# EAGLE design motadora (EAGLE 8.2.2)
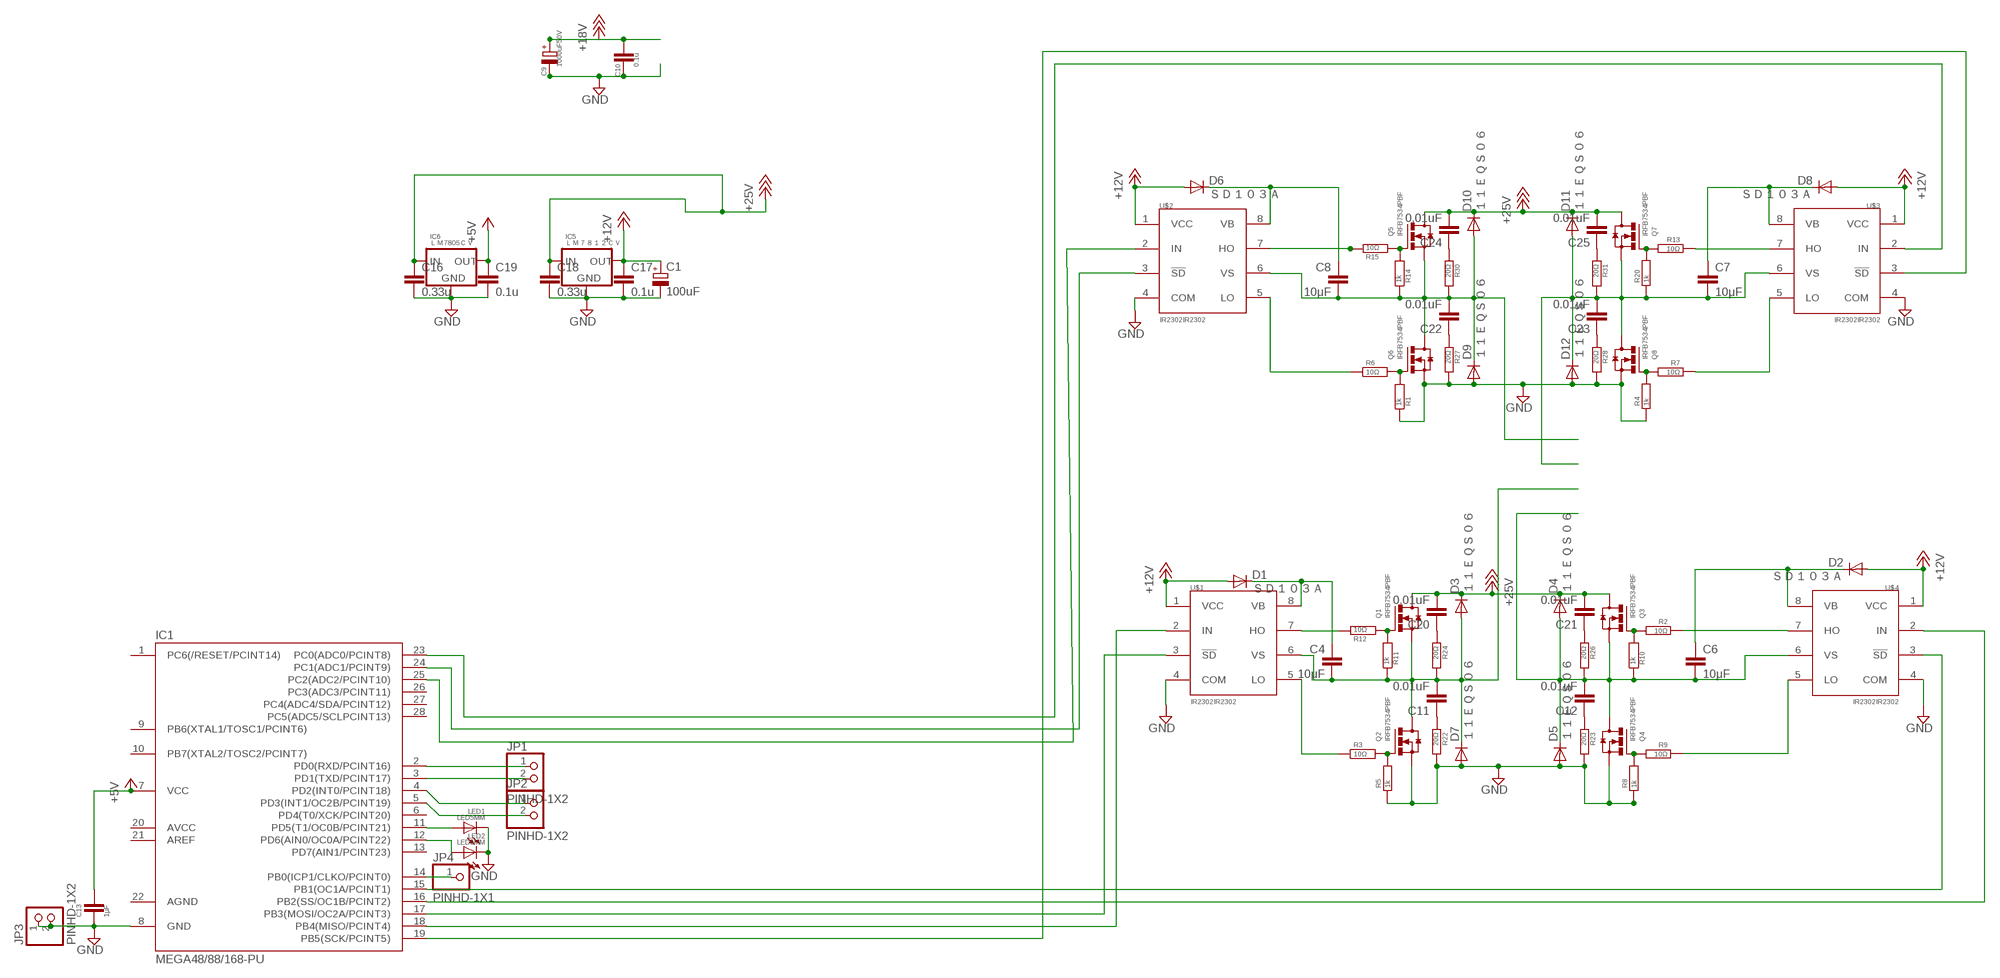
[diagram p0: schematic, sheet 1]

## Parts
C1  100uF  CPOL-EUTT2D6  [TT2D6]
C4  10μF  C-EU025-025X050  [C025-025X050]
C6  10μF  C-EU025-025X050  [C025-025X050]
C7  10μF  C-EU025-025X050  [C025-025X050]
C8  10μF  C-EU025-025X050  [C025-025X050]
C9  1000uF50V  CPOL-E2.5-7  [E2,5-7]
C10  0.1u  C-025-025X050  [C025-025X050]
C11  0.01uF  C-EU025-024X044  [C025-024X044]
C12  0.01uF  C-EU025-024X044  [C025-024X044]
C13  1μF  C>>025-025X050  [C025-025X050]
C16  0.33u  C-EU025-025X050  [C025-025X050]
C17  0.1u  C-EU025-025X050  [C025-025X050]
C18  0.33u  C-EU025-025X050  [C025-025X050]
C19  0.1u  C-EU025-025X050  [C025-025X050]
C20  0.01uF  C-EU025-024X044  [C025-024X044]
C21  0.01uF  C-EU025-024X044  [C025-024X044]
C22  0.01uF  C-EU025-024X044  [C025-024X044]
C23  0.01uF  C-EU025-024X044  [C025-024X044]
C24  0.01uF  C-EU025-024X044  [C025-024X044]
C25  0.01uF  C-EU025-024X044  [C025-024X044]
D1  ＳＤ１０３Ａ  DIODE-D-5  [D-5]
D2  ＳＤ１０３Ａ  DIODE-D-5  [D-5]
D3  １１ＥＱＳ０６  DIODE-D-5  [D-5]
D4  １１ＥＱＳ０６  DIODE-D-5  [D-5]
D5  １１ＥＱＳ０６  DIODE-D-5  [D-5]
D6  ＳＤ１０３Ａ  DIODE-D-5  [D-5]
D7  １１ＥＱＳ０６  DIODE-D-5  [D-5]
D8  ＳＤ１０３Ａ  DIODE-D-5  [D-5]
D9  １１ＥＱＳ０６  DIODE-D-5  [D-5]
D10  １１ＥＱＳ０６  DIODE-D-5  [D-5]
D11  １１ＥＱＳ０６  DIODE-D-5  [D-5]
D12  １１ＥＱＳ０６  DIODE-D-5  [D-5]
IC1  MEGA48/88/168-PU  [DIL28-3]
IC5  ＬＭ７８１２ＣＶ  V_REG>>TO-92  [TO-92]
IC6  ＬＭ7805ＣＶ  V_REG>>TO-92  [TO-92]
JP1  PINHD-1X2  [1X02]
JP2  PINHD-1X2  [1X02]
JP3  PINHD-1X2  [1X02]
JP4  PINHD-1X1  [1X01]
LED1  LED5MM  [LED5MM]
LED2  LED5MM  [LED5MM]
Q1  IRFB7534PBF  MOS-FET_NTO-220_2  [TO220_2]
Q2  IRFB7534PBF  MOS-FET_NTO-220_2  [TO220_2]
Q3  IRFB7534PBF  MOS-FET_NTO-220_2  [TO220_2]
Q4  IRFB7534PBF  MOS-FET_NTO-220_2  [TO220_2]
Q5  IRFB7534PBF  MOS-FET_NTO-220_2  [TO220_2]
Q6  IRFB7534PBF  MOS-FET_NTO-220_2  [TO220_2]
Q7  IRFB7534PBF  MOS-FET_NTO-220_2  [TO220_2]
Q8  IRFB7534PBF  MOS-FET_NTO-220_2  [TO220_2]
R1  1k  R-EU_1/4W(8MM)  [1/4W(8MM)]
R2  10Ω  R-EU_1/4W(2.5MM)_  [1/4W(2.5MM)_]
R3  10Ω  R-EU_1/4W(2.5MM)_  [1/4W(2.5MM)_]
R4  1k  R-EU_1/4W(8MM)  [1/4W(8MM)]
R5  1k  R-EU_1/4W(8MM)  [1/4W(8MM)]
R6  10Ω  R-EU_1/4W(2.5MM)_  [1/4W(2.5MM)_]
R7  10Ω  R-EU_1/4W(2.5MM)_  [1/4W(2.5MM)_]
R8  1k  R-EU_1/4W(8MM)  [1/4W(8MM)]
R9  10Ω  R-EU_1/4W(2.5MM)_  [1/4W(2.5MM)_]
R10  1k  R-EU_1/4W(8MM)  [1/4W(8MM)]
R11  1k  R-EU_1/4W(8MM)  [1/4W(8MM)]
R12  10Ω  R-EU_1/4W(2.5MM)_  [1/4W(2.5MM)_]
R13  10Ω  R-EU_1/4W(2.5MM)_  [1/4W(2.5MM)_]
R14  1k  R-EU_1/4W(8MM)  [1/4W(8MM)]
R15  10Ω  R-EU_1/4W(2.5MM)_  [1/4W(2.5MM)_]
R20  1k  R-EU_1/4W(8MM)  [1/4W(8MM)]
R22  20Ω  R-EU_1/4W(2.5MM)_  [1/4W(2.5MM)_]
R23  20Ω  R-EU_1/4W(2.5MM)_  [1/4W(2.5MM)_]
R24  20Ω  R-EU_1/4W(2.5MM)_  [1/4W(2.5MM)_]
R26  20Ω  R-EU_1/4W(2.5MM)_  [1/4W(2.5MM)_]
R27  20Ω  R-EU_1/4W(2.5MM)_  [1/4W(2.5MM)_]
R28  20Ω  R-EU_1/4W(2.5MM)_  [1/4W(2.5MM)_]
R30  20Ω  R-EU_1/4W(2.5MM)_  [1/4W(2.5MM)_]
R31  20Ω  R-EU_1/4W(2.5MM)_  [1/4W(2.5MM)_]
U$1  IR2302IR2302  [DIL08]
U$2  IR2302IR2302  [DIL08]
U$3  IR2302IR2302  [DIL08]
U$4  IR2302IR2302  [DIL08]

## Nets
+5V: C13.1 C19.1 IC1.7(VCC) IC6.1(OUT)
+12V: C1.+ C17.1 D1.A D2.A D6.A D8.A IC5.1(OUT) U$1.1(VCC) U$2.1(VCC) U$3.1(VCC) U$4.1(VCC)
+18V: C9.+ C10.1 C16.1 C18.1 C20.2 C21.2 C24.2 C25.2 D3.C D4.C D10.C D11.C IC5.3(IN) IC6.3(IN) Q1.2(D) Q3.2(D) Q5.2(D) Q7.2(D) ; supply symbol labelled +25V
GND: C1.- C9.- C10.2 C13.2 C16.2 C17.2 C18.2 C19.2 D5.A D7.A D9.A D12.A IC1.8(GND) IC5.2(GND) IC6.2(GND) JP3.1 JP3.2 LED1.K(C) LED2.K(C) Q2.3(S) Q4.3(S) Q6.3(S) Q8.3(S) R1.1 R4.1 R5.1 R8.1 R22.4 R23.4 R27.4 R28.4 U$1.4(COM) U$2.4(COM) U$3.4(COM) U$4.4(COM)
N$1: R15.3 U$2.7(HO)
N$2: R13.3 U$3.7(HO)
N$3: R12.3 U$1.7(HO)
N$4: Q2.1(G) R3.4 R5.2
N$5: R2.3 U$4.7(HO)
N$6: R6.3 U$2.5(LO)
N$7: Q1.1(G) R11.2 R12.4
N$8: C4.2 C11.2 D3.A D7.C Q1.3(S) Q2.2(D) R11.1 R24.4 U$1.6(VS)
N$9: C4.1 D1.C U$1.8(VB)
N$10: C6.1 D2.C U$4.8(VB)
N$11: R3.3 U$1.5(LO)
N$12: C7.1 D8.C U$3.8(VB)
N$13: Q5.1(G) R14.2 R15.4
N$15: C6.2 C12.2 D4.A D5.C Q3.3(S) Q4.2(D) R10.1 R26.4 U$4.6(VS)
N$16: C8.1 D6.C U$2.8(VB)
N$17: Q4.1(G) R8.2 R9.4
N$18: IC1.11(PD5(T1/OC0B/PCINT21)) LED1.A
N$19: C7.2 C23.2 D11.A D12.C Q7.3(S) Q8.2(D) R20.1 R31.4 U$3.6(VS)
N$20: IC1.17(PB3(MOSI/OC2A/PCINT3)) U$1.3(!SD)
N$21: Q6.1(G) R1.2 R6.4
N$22: IC1.15(PB1(OC1A/PCINT1)) U$4.3(!SD)
N$23: IC1.12(PD6(AIN0/OC0A/PCINT22)) LED2.A
N$24: IC1.24(PC1(ADC1/PCINT9)) U$2.3(!SD)
N$25: IC1.2(PD0(RXD/PCINT16)) JP1.1
N$26: Q8.1(G) R4.2 R7.4
N$27: C8.2 C22.2 D9.C D10.A Q5.3(S) Q6.2(D) R14.1 R30.4 U$2.6(VS)
N$32: IC1.16(PB2(SS/OC1B/PCINT2)) U$4.2(IN)
N$33: IC1.3(PD1(TXD/PCINT17)) JP1.2
N$34: IC1.4(PD2(INT0/PCINT18)) JP2.1
N$36: C12.1 R23.3
N$37: IC1.5(PD3(INT1/OC2B/PCINT19)) JP2.2
N$38: C11.1 R22.3
N$39: Q3.1(G) R2.4 R10.2
N$40: R7.3 U$3.5(LO)
N$41: IC1.23(PC0(ADC0/PCINT8)) U$3.2(IN)
N$42: C20.1 R24.3
N$43: C21.1 R26.3
N$44: C22.1 R27.3
N$45: C23.1 R28.3
N$46: C24.1 R30.3
N$47: C25.1 R31.3
N$49: IC1.19(PB5(SCK/PCINT5)) U$3.3(!SD)
N$50: IC1.18(PB4(MISO/PCINT4)) U$1.2(IN)
N$51: Q7.1(G) R13.4 R20.2
N$52: IC1.25(PC2(ADC2/PCINT10)) U$2.2(IN)
N$53: IC1.14(PB0(ICP1/CLKO/PCINT0)) JP4.1
N$54: R9.3 U$4.5(LO)
Unconnected: IC1.1(PC6(/RESET/PCINT14)) IC1.6(PD4(T0/XCK/PCINT20)) IC1.9(PB6(XTAL1/TOSC1/PCINT6)) IC1.10(PB7(XTAL2/TOSC2/PCINT7)) IC1.13(PD7(AIN1/PCINT23)) IC1.20(AVCC) IC1.21(AREF) IC1.26(PC3(ADC3/PCINT11)) IC1.27(PC4(ADC4/SDA/PCINT12)) IC1.28(PC5(ADC5/SCLPCINT13))

## Power pins joined to a net without a drawn wire
AGND: IC1.22(AGND)

## Library data of the parts
C1 = _rcl:CPOL-EU: POLARIZED CAPACITOR, European symbol
C4 C6-C8 = _rcl:C-EU: CAPACITOR, European symbol
C9 = !Capasiter:CPOL-: POLARIZED CAPACITOR, European symbol
C10 = !Capasiter:C-: CAPACITOR, European symbol
C11 C12 C16-C25 = _resistor(抵抗):C-EU: CAPACITOR, European symbol
C13 = !Capasiter:C>>: CAPACITOR, European symbol
D1-D12 = _diode(ﾀﾞｲｵｰﾄﾞ):DIODE-: DIODE
IC1 = !avr:MEGA48/88/168-PU
IC5 IC6 = !FET_transister_v-reg:V_REG>>
JP1-JP3 = !pinhead(ﾋﾟﾝﾍｯﾀﾞ):PINHD-1X2: PIN HEADER
JP4 = !pinhead(ﾋﾟﾝﾍｯﾀﾞ):PINHD-1X1: PIN HEADER
LED1 LED2 = _led:LED
Q1-Q8 = !FET_transister_v-reg2:MOS-FET_N
R1-R15 R20 R22-R24 R26-R28 R30 R31 = !Resistor(抵抗):R-EU_: RESISTOR, European symbol
U$1-U$4 = !irs(ｹﾞｰﾄﾄﾞﾗｲﾊﾞIC):IR2302

## Board
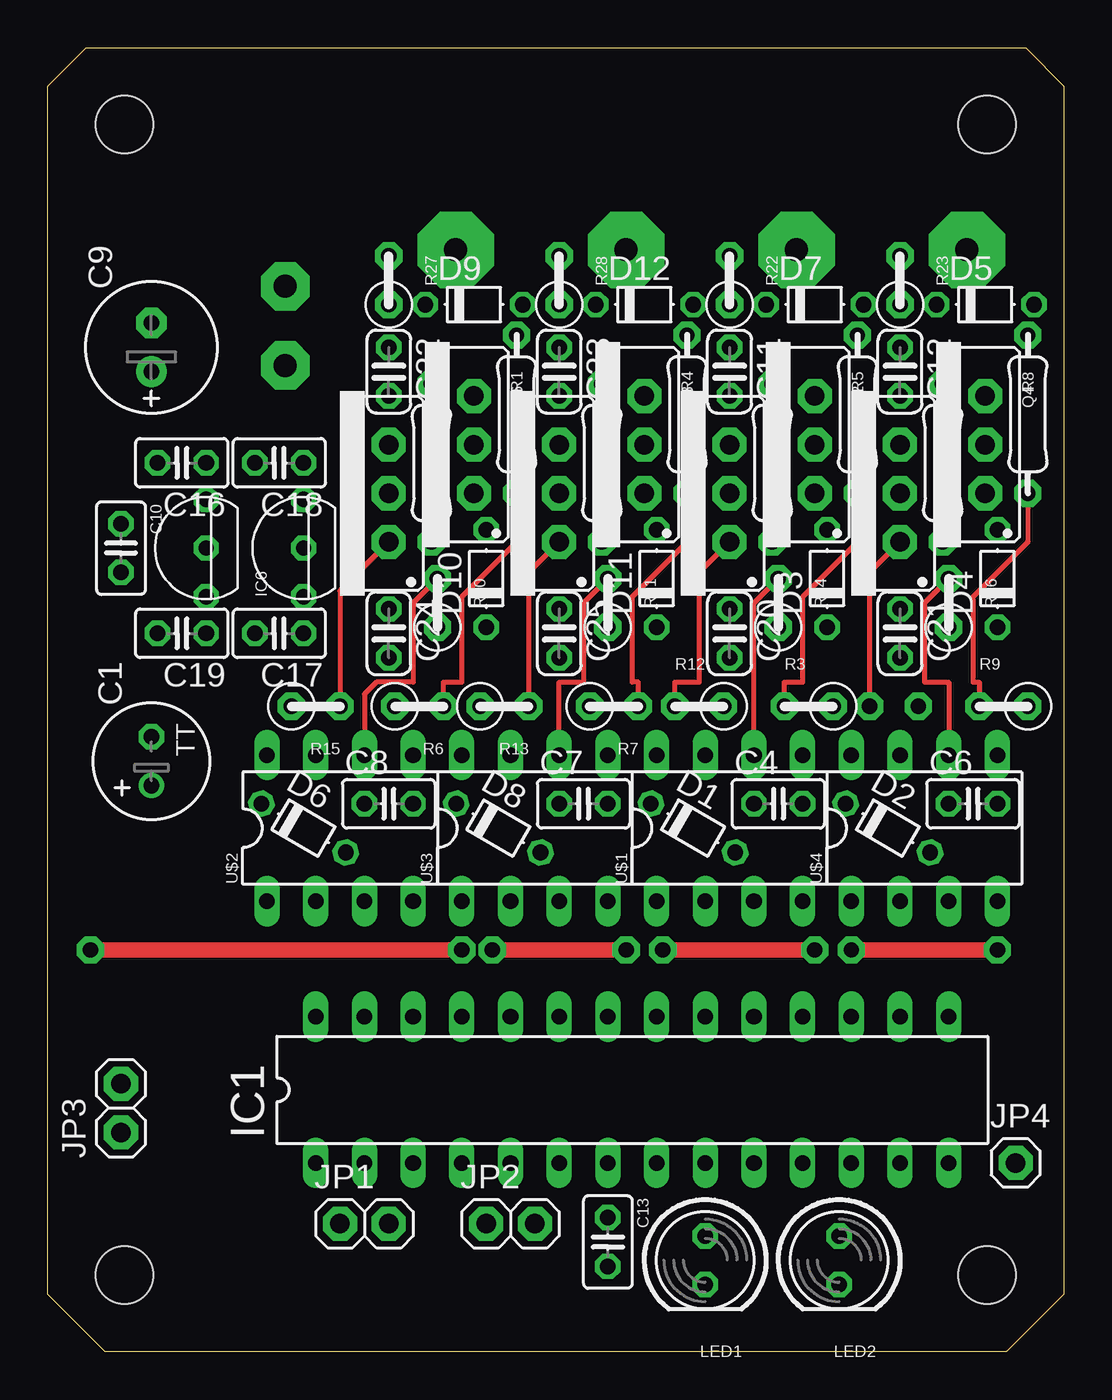
[diagram p1: board, top side]
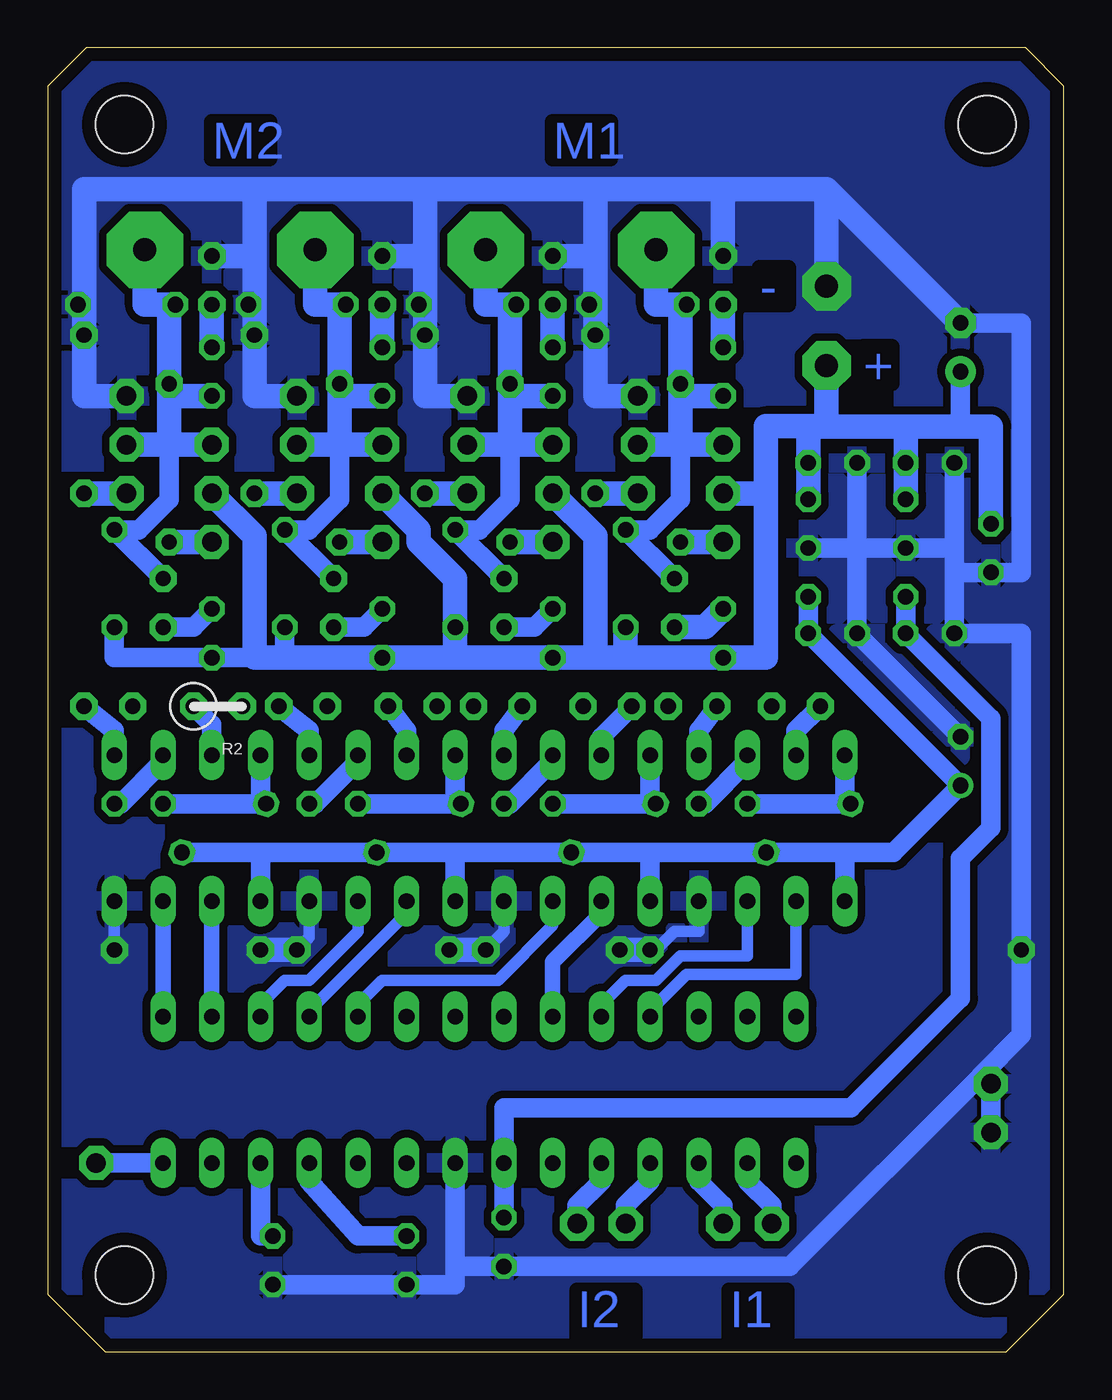
[diagram p2: board, bottom side, seen from below]

Size 53 x 68 mm. Coordinates in mm from the lower left corner, seen from the top.
Outline: 0,3 0,66 2,68 51,68 53,66 53,3 50,0 3,0 0,3
Copper layers (1*16): Top 0.035mm / dielectric 1.5mm / Bottom 0.035mm
Design rules "default *": minimum track width 10mil, minimum drill 24mil, track to track 8mil, track to pad 8mil, pad to pad 8mil, via to via 8mil, smd to smd 8mil, copper to edge 0.7mm, drill to drill 8mil, minimum pad ring 10mil, minimum via ring 8mil, stop-mask expansion 4mil, vias tented up to drill 0mil, thermal gap 10mil
Holes 3 mm at 4,4 49,4 49,64 4,64

### Footprints (pad centres in the part's own frame; a part is rotated, then mirrored left to right if it is on the bottom)
TT2D6 = drill 0.813: + -1.27,0 | drill 0.813 octagon: - 1.27,0
C025-025X050 = drill 0.813 octagon: 1 -1.27,0; 2 1.27,0
E2,5-7 = drill 0.813 pad 1.6: + -1.27,0 | drill 0.813 pad 1.6 octagon: - 1.27,0
C025-024X044 = drill 0.813 octagon: 1 -1.27,0; 2 1.27,0
D-5 = drill 0.813 octagon: A 2.54,0; C -2.54,0
DIL28-3 = drill 0.813 long: 1 -16.51,-3.81; 2 -13.97,-3.81; 3 -11.43,-3.81; 4 -8.89,-3.81; 5 -6.35,-3.81; 6 -3.81,-3.81; 7 -1.27,-3.81; 8 1.27,-3.81; 9 3.81,-3.81; 10 6.35,-3.81; 11 8.89,-3.81; 12 11.43,-3.81; 13 13.97,-3.81; 14 16.51,-3.81; 15 16.51,3.81; 16 13.97,3.81; 17 11.43,3.81; 18 8.89,3.81; 19 6.35,3.81; 20 3.81,3.81; 21 1.27,3.81; 22 -1.27,3.81; 23 -3.81,3.81; 24 -6.35,3.81; 25 -8.89,3.81; 26 -11.43,3.81; 27 -13.97,3.81; 28 -16.51,3.81
TO-92 = drill 0.8 octagon: 1 -2.54,0; 2 0,0; 3 2.54,0
1X02 = drill 1.016 pad 1.778 octagon: 1 -1.27,0; 2 1.27,0
1X01 = drill 1.016 pad 1.778 octagon: 1 0,0
LED5MM = drill 0.813 octagon: A -1.27,0; K 1.27,0
TO220_2 = drill 1.016 pad 1.778 octagon: 1 -2.54,0; 2 0,0; 3 2.54,0
1/4W(8MM) = drill 0.8 pad 1.422 octagon: 1 -4.128,0; 2 4.128,0
1/4W(2.5MM)_ = drill 0.8 pad 1.422 octagon: 3 1.27,0; 4 -1.27,0
DIL08 = drill 0.813 long: 1 -3.81,-3.81; 2 -1.27,-3.81; 3 1.27,-3.81; 4 3.81,-3.81; 5 3.81,3.81; 6 1.27,3.81; 7 -1.27,3.81; 8 -3.81,3.81

### Placement (x,y rotation side)
C1  5.4,30.8 90 top
C4  38.1,28.57 0 top
C6  48.26,28.57 0 top
C7  27.94,28.57 0 top
C8  17.78,28.57 0 top
C9  5.4,52.39 90 top
C10  3.81,41.91 270 top
C11  35.56,51.12 270 top
C12  44.45,51.12 270 top
C13  29.21,5.71 270 top
C16  6.99,46.35 180 top
C17  12.06,37.47 180 top
C18  12.06,46.35 180 top
C19  6.99,37.47 180 top
C20  35.56,37.47 270 top
C21  44.45,37.47 270 top
C22  17.78,51.12 270 top
C23  26.67,51.12 270 top
C24  17.78,37.47 270 top
C25  26.67,37.47 270 top
D1  33.66,27.3 330 top
D2  43.81,27.3 330 top
D3  40.64,40.32 90 top
D4  49.53,40.32 90 top
D5  48.9,54.61 0 top
D6  13.34,27.3 330 top
D7  40.01,54.61 0 top
D8  23.5,27.3 330 top
D9  22.23,54.61 0 top
D10  22.86,40.32 90 top
D11  31.75,40.32 90 top
D12  31.11,54.61 0 top
IC1  30.48,13.65 0 top
IC5  13.34,41.91 90 top
IC6  8.26,41.91 90 top
JP1  16.51,6.67 0 top
JP2  24.13,6.67 0 top
JP3  3.81,12.7 90 top
JP4  50.48,9.84 0 top
LED1  34.29,4.76 270 top
LED2  41.27,4.76 270 top
Q1  35.56,44.77 90 top
Q2  40.01,47.31 90 top
Q3  44.45,44.77 90 top
Q4  48.9,47.31 90 top
Q5  17.78,44.77 90 top
Q6  22.23,47.31 90 top
Q7  26.67,44.77 90 top
Q8  31.11,47.31 90 top
R1  24.45,48.9 270 top
R2  44.13,33.66 180 bottom
R3  39.69,33.66 0 top
R4  33.34,48.9 270 top
R5  42.23,48.9 270 top
R6  19.37,33.66 180 top
R7  29.53,33.66 180 top
R8  51.12,48.9 270 top
R9  49.85,33.66 0 top
R10  46.67,46.35 270 top
R11  37.78,46.35 270 top
R12  33.97,33.66 0 top
R13  23.81,33.66 180 top
R14  20,46.35 270 top
R15  13.97,33.66 180 top
R20  28.89,46.35 270 top
R22  35.56,55.88 270 top
R23  44.45,55.88 270 top
R24  38.1,39.05 270 top
R26  46.99,39.05 270 top
R27  17.78,55.88 270 top
R28  26.67,55.88 270 top
R30  20.32,39.05 270 top
R31  29.21,39.05 270 top
U$1  35.56,27.3 0 top
U$2  15.24,27.3 0 top
U$3  25.4,27.3 0 top
U$4  45.72,27.3 0 top

### Tracks (layer width: path | path; a pad name or v marks a point on that pad's centre or on a via)
+5V
  Bottom 1.016: IC6.1 C19.1 3.81,33.02 3.81,27.3 5.4,25.72 5.4,18.41 11.11,12.7 29.21,12.7 IC1.7 C13.1
+12V
  Bottom 1.016: IC5.1 C17.1 | C17.1 13.34,37.78 | 41.91,26.04 D1.A 31.75,26.04 | 41.91,26.04 D2.A | 31.75,26.04 D8.A 21.48,26.04 | U$1.1 31.75,26.04 | 21.48,26.04 D6.A 11.43,26.04 | 11.43,26.04 U$2.1 | C17.1 C1.+ 8.89,26.04 11.43,26.04 | U$4.1 41.91,26.04 | U$3.1 21.59,25.93 21.48,26.04
+18V  (via drill 1.2 pad 2.54)
  Bottom 1.016: D3.C 40.64,36.2 | D4.C 49.53,36.2 C21.2 42.23,36.2 | C9.+ 5.4,48.26 6.55,48.26
  Bottom 1.27: Q7.2 24.45,42.55 24.45,36.2 | Q5.2 15.56,44.77 | 24.45,36.2 22.86,36.2 | 22.86,36.2 C24.2 15.56,36.2 15.56,44.77 | 31.75,36.2 C25.2 24.45,36.2 | Q3.2 42.23,42.55 42.23,36.2 40.64,36.2 C20.2 31.75,36.2 | IC6.3 C16.1 8.26,48.26 | IC5.3 C18.1 13.34,48.26 | 15.56,44.77 15.56,48.27 13.34,48.27 | 31.75,36.2 D11.C 31.75,40.32 33.66,42.23 33.66,42.86 Q1.2 | D10.C 22.86,36.2 | C10.1 3.81,48.26 6.55,48.26 8.26,48.26 | 8.26,48.26 13.34,48.26 | 13.34,48.26 13.34,48.27 | 13.34,48.27 12.38,48.27 v12.38,51.44
GND  (via drill 0.8 pad 1.42, 1.2 pad 2.54)
  Top 0.813: v2.22,20.95 v21.59,20.95 | v23.18,20.95 v30.16,20.95 | v32.07,20.95 v40.01,20.95 | v41.91,20.95 v49.53,20.95
  Bottom 0.61: U$2.4 19.05,21.91 20.32,21.91 21.27,20.95 v21.59,20.95 | U$3.4 29.21,21.91 v30.16,20.95 | U$1.4 39.37,21.59 v40.01,20.95 | v49.53,20.95 U$4.4
  Bottom 1.016: 5.71,41.91 IC6.2 10.79,41.91 | 5.71,40.64 C19.2 2.22,37.47 v2.22,20.95 2.22,16.51 4.37,14.36 | IC5.2 10.79,41.91 | 5.71,41.91 C16.2 | C18.2 10.79,41.91 | 10.79,41.91 C17.2 C1.- | 5.71,41.91 5.71,40.64 | 5.71,40.64 C10.2 2.22,40.64 2.22,53.66 C9.- | IC1.8 31.75,4.45 | C13.2 31.75,4.45 | C13.2 28.89,4.45 | 31.75,4.45 31.75,3.49 LED1.K LED2.K | C13.2 14.29,4.45 4.37,14.36 | JP3.1 JP3.2 3.98,13.97 4.37,14.36
  Bottom 1.27: 24.45,57.15 24.45,60.64 | Q8.3 33.34,49.85 R4.1 33.34,54.53 | 33.34,54.53 33.34,57.15 | Q6.3 24.45,49.85 R1.1 | 24.45,50.8 R1.1 | R28.4 24.45,57.15 | 17.78,60.64 24.45,60.64 | 17.78,60.64 R27.4 | 24.45,54.4 R1.1 | 24.45,54.4 24.45,57.15 | 42.23,57.15 42.23,60.64 | R22.4 33.34,57.15 | 33.34,57.15 33.34,60.64 | Q4.3 51.12,49.85 R8.1 51.12,54.4 | Q2.3 42.23,49.85 R5.1 42.23,54.6 | 42.23,54.6 42.23,57.15 | 42.23,57.15 R23.4 | v21.59,20.95 v23.18,20.95 | v30.16,20.95 v32.07,20.95 | v40.01,20.95 v41.91,20.95 | D9.A 24.56,54.4 24.45,54.4 | D12.A 33.58,54.53 33.34,54.53 | D7.A 42.53,54.6 42.23,54.6 | D5.A 51.23,54.4 51.12,54.4 | 24.45,60.64 33.34,60.64 | 33.34,60.64 42.23,60.64 | C9.- 12.38,60.64 | 12.38,60.64 17.78,60.64 | 12.38,60.64 v12.38,55.56 | 42.23,60.64 51.12,60.64 51.12,54.4
  pour Bottom (isolate 0.406): -3.49,69.22 -3.49,-6.67 56.52,-6.67 56.52,69.22
N$1
  Bottom 1.016: R15.3 13.97,32.38 U$2.7
N$2
  Bottom 1.016: U$3.7 24.13,32.07 R13.3
N$3
  Bottom 1.016: R12.3 34.29,32.38 U$1.7
N$4
  Top 0.254: R5.2 42.23,42.23 39.37,39.37 39.37,34.92 38.42,34.92 R3.4
  Bottom 1.27: Q2.1 R5.2
N$5
  Bottom 1.016: U$4.7 44.45,32.7 R2.3
N$6
  Bottom 1.016: R6.3 19.05,32.38 U$2.5
N$7
  Top 0.254: Q1.1 33.97,40.64 33.97,34.92 32.7,34.92 R12.4
  Bottom 1.27: Q1.1 R11.2
N$8  (via drill 1.2 pad 4)
  Top 0.254: U$1.6 36.83,39.05 R24.4
  Bottom 1.016: C4.2 39.05,28.57 36.83,30.8 U$1.6 | R24.4 D3.A 39.37,42.86 37.78,44.45 37.78,47.31
  Bottom 1.27: 37.78,47.31 Q1.3 | 37.78,47.31 R11.1 | R11.1 37.78,47.62 | 37.78,47.31 Q2.2 | R11.1 37.78,49.85 C11.2 | R11.1 37.78,54.59 37.49,54.59 D7.C 39.05,54.61 v39.05,57.47
N$9
  Bottom 1.016: 31.77,31.09 U$1.8 31.75,28.87 D1.C C4.1
N$10
  Bottom 1.016: C6.1 D2.C 41.91,28.6 U$4.8
N$11
  Bottom 1.016: R3.3 39.37,32.38 U$1.5
N$12
  Bottom 1.016: C7.1 D8.C 21.59,28.6 U$3.8
N$13
  Top 0.254: R15.4 15.24,39.69 Q5.1
  Bottom 1.27: R14.2 Q5.1
N$15  (via drill 1.2 pad 4)
  Top 0.254: R26.4 45.72,39.05 45.72,34.92 46.99,34.92 U$4.6
  Bottom 1.016: C6.2 49.21,28.57 46.99,30.8 U$4.6 | R26.4 D4.A 48.26,42.86 46.67,44.45 46.67,47.31
  Bottom 1.27: 46.67,47.31 Q3.3 | R10.1 46.67,47.31 | Q4.2 46.67,47.31 | R10.1 46.67,49.85 C12.2 | R10.1 46.67,54.61 D5.C 47.94,54.61 v47.94,57.47
N$16
  Bottom 1.016: 11.43,28.57 U$2.8 | 11.43,28.57 C8.1 | D6.C 11.43,28.57
N$17
  Top 0.254: R8.2 51.12,42.23 48.26,39.37 48.26,34.92 48.58,34.92 R9.4
  Bottom 1.27: Q4.1 R8.2
N$18
  Bottom 1.016: LED1.A 36.83,6.03 39.37,8.89 IC1.11
N$19  (via drill 1.2 pad 4)
  Top 0.254: R31.4 27.94,39.05 27.94,34.92 26.67,34.92 U$3.6
  Bottom 1.016: C7.2 28.89,28.57 26.67,30.8 U$3.6 | 28.89,47.31 28.89,44.45 30.48,42.86 D11.A R31.4
  Bottom 1.27: R20.1 28.89,47.31 | 28.89,47.31 Q7.3 | Q8.2 28.89,47.31 | 28.89,47.62 R20.1 | R20.1 28.89,49.85 C23.2 | R20.1 28.89,54.53 28.65,54.53 D12.C 30.16,54.61 v30.16,57.47
N$20
  Bottom 0.61: U$1.3 36.83,21.91 39.37,19.37 40.64,19.37 41.91,18.1 IC1.17
N$21
  Top 0.254: R1.2 24.45,42.23 21.59,39.37 21.59,34.92 20.64,34.92 R6.4
  Bottom 1.27: Q6.1 R1.2
N$22
  Bottom 0.813: U$4.3 IC1.15
N$23
  Bottom 1.016: LED2.A 41.91,6.03 IC1.12
N$24
  Bottom 0.61: U$2.3 16.51,20.64 20,20.64 21.27,19.37 22.86,19.37 24.13,18.1 IC1.24
N$25
  Bottom 1.016: IC1.2 16.51,8.89 15.24,7.62 JP1.1
N$26
  Top 0.254: R4.2 33.34,42.23 30.48,39.37 30.48,34.92 30.8,34.92 R7.4
  Bottom 1.27: Q8.1 R4.2
N$27  (via drill 1.2 pad 4)
  Top 0.254: U$2.6 16.51,34.29 17.14,34.92 19.05,34.92 19.05,39.05 R30.4
  Bottom 1.016: C8.2 18.73,28.57 16.51,30.8 U$2.6 | R30.4 D10.A 21.59,42.86 20,44.45 20,47.31
  Bottom 1.27: 20,47.31 Q6.2 | Q5.3 20,47.31 | 20,47.31 20,49.85 | 20,49.85 R14.1 20,54.57 19.72,54.57 D9.C 21.27,54.61 v21.27,57.47 | C22.2 20,49.85
N$32
  Bottom 0.813: U$4.2 IC1.16
N$33
  Bottom 1.016: IC1.3 19.05,8.89 17.78,7.62 JP1.2
N$34
  Bottom 1.016: IC1.4 21.59,8.89 22.86,7.62 JP2.1
N$36
  Bottom 1.27: C12.1 R23.3
N$37
  Bottom 1.016: IC1.5 24.13,8.89 25.4,7.62 JP2.2
N$38
  Bottom 1.27: C11.1 R22.3
N$39
  Top 0.254: R2.4 42.86,40.64 Q3.1
  Bottom 1.27: Q3.1 R10.2
N$40
  Bottom 1.016: R7.3 29.21,32.38 U$3.5
N$41
  Bottom 0.813: U$3.2 24.13,22.86 26.67,20.32 IC1.23
N$42
  Bottom 1.016: C20.1 36.51,37.78 R24.3
N$43
  Bottom 1.016: C21.1 45.4,37.78 R26.3
N$44
  Bottom 1.27: R27.3 C22.1
N$45
  Bottom 1.27: C23.1 R28.3
N$46
  Bottom 1.27: C24.1 18.73,37.78 R30.3
N$47
  Bottom 1.016: C25.1 27.62,37.78 R31.3
N$49
  Bottom 0.61: U$3.3 26.67,22.23 29.53,19.37 35.56,19.37 36.83,18.1 IC1.19
N$50
  Bottom 0.61: U$1.2 34.29,22.86 39.37,17.78 IC1.18
N$51
  Top 0.254: Q7.1 25.08,40.64 R13.4
  Bottom 1.27: R20.2 Q7.1
N$52
  Bottom 0.61: U$2.2 13.97,19.68 19.68,19.68 21.59,17.78 IC1.25
N$53
  Bottom 1.016: IC1.14 JP4.1
N$54
  Bottom 1.016: R9.3 49.53,32.38 U$4.5

### Text on the board
Bottom: M1 | M2 | - | + | I1 | I2